# Altium schematic sheet Power_Regulators_Ether2V5.SchDoc
size A4; DocumentNumber: 39; SheetNumber: 39; SheetTotal: 47
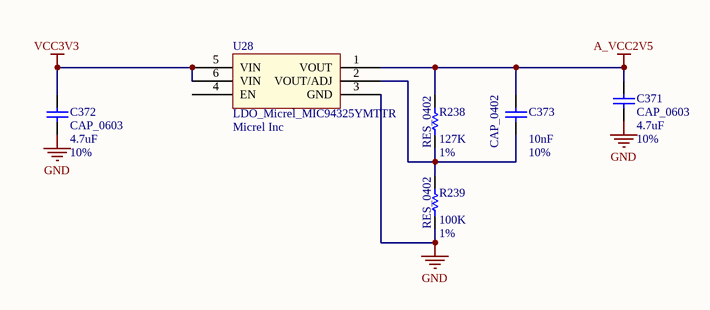
[diagram p0: Power_Regulators_Ether2V5.SchDoc]

## Parts
C371  CAP_0603  value 4.7uF  Tolerance: 10%  [CAPC0603(1608)100_N]
C372  CAP_0603  value 4.7uF  Tolerance: 10%  [CAPC0603(1608)100_N]
C373  CAP_0402  value 10nF  Tolerance: 10%  [CAPC0402(1005)60_N]
R238  RES_0402  value 127K  Tolerance: 1%  [RESC0402(1005)_N]
R239  RES_0402  value 100K  Tolerance: 1%  [RESC0402(1005)_N]
U28  LDO_Micrel_MIC94325YMTTR  Manufacturer: Micrel Inc  [LDO_Micrel_MIC94325YMTTR_TDFN-6]

## Nets
A_VCC2V5: C371.2 C373.2 R238.2 U28.1(VOUT)
GND: C371.1 C372.1 R239.1 U28.3(GND)
VCC3V3: C372.2 U28.5(VIN) U28.6(VIN)
NetC373_1: C373.1 R238.1 R239.2 U28.2(VOUT/ADJ)

Not connected (* = marked no-connect by the designer): U28 4(EN)

## Library data of the parts
C371 C372 = LMK107BJ475KA-T: 4.7uF, ceramic, 10%, 10V X5R, 0603; Manufacturer: Taiyo Yuden; Part Number: LMK107BJ475KA-T; Footprint Ref: CAPC0603(1608)100_N; Library Ref: CAP_0603
C373 = GRM155R60J103KA01D: 10000pF, ceramic, 10% 6.3V X5R, 0402; Manufacturer: Murata Electronics North America; Part Number: GRM155R60J103KA01D; Footprint Ref: CAPC0402(1005)60_N; Library Ref: CAP_0402
R238 = MCR01MZPF1273: 127K ohm, 1%, 1/16W, 0402; Manufacturer: ROHM; Part Number: MCR01MZPF1273; Footprint Ref: RESC0402(1005)_N; Library Ref: RES_0402
R239 = MCR01MZPF1003: 100K ohm, 1%, 1/16W, 0402; Manufacturer: ROHM; Part Number: MCR01MZPF1003; Footprint Ref: RESC0402(1005)_N; Library Ref: RES_0402
U28 = MIC94325YMTTR: IC REG LDO ADJ .5A 6TDFN; Part Number: MIC94325YMTTR; Footprint Ref: LDO_Micrel_MIC94325YMTTR_TDFN-6; Library Ref: LDO_Micrel_MIC94325YMTTR